# EAGLE design RefVolt (EAGLE 8.0.1)
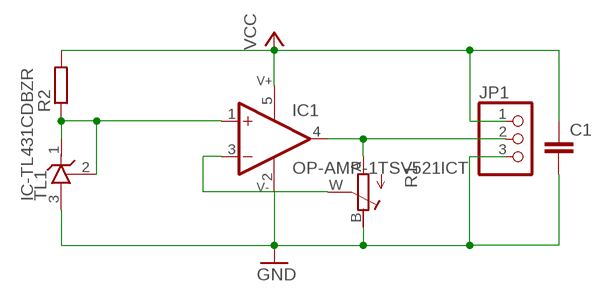
[diagram p0: schematic, sheet 1]

## Parts
C1  CAP_0805  [C0805]
IC1  OP-AMP-1TSV521ICT  [SC70-5L]
JP1  PINHD-1X3/90  [1X03/90]
R1  R_POTTURN-X  [RJ9W]
R2  R_0805  [R0805]
TL1  IC-TL431CDBZR  [SOT23]

## Nets
GND: C1.2 IC1.2(V-) JP1.3 R1.B(E) TL1.3(A)
N$1: IC1.3(-IN) R1.W(S)
N$4: IC1.4(OUT) JP1.2 R1.A
N$7: IC1.1(+IN) R2.1 TL1.1(C) TL1.2(R)
VCC: C1.1 IC1.5(V+) JP1.1 R2.2

## Library data of the parts
C1 = Namenlos:CAP_
IC1 = Namenlos:OP-AMP-1
JP1 = pinhead:PINHD-1X3: PIN HEADER
R1 = Namenlos:R_POT
R2 = Namenlos:R_
TL1 = Namenlos:IC-TL431

## Board
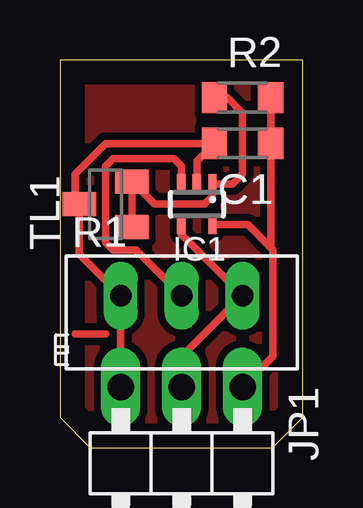
[diagram p1: board, top side]

Size 10.14 x 16.18 mm. Coordinates in mm from the lower left corner, seen from the top.
Outline: 0,16.18 0,1.27 1.27,0 8.87,0 10.14,1.27 10.14,16.18 0,16.18
Copper layers (1*16): Top 0.035mm / dielectric 1.5mm / Bottom 0.035mm
Design rules "default": minimum track width 10mil, minimum drill 24mil, track to track 8mil, track to pad 8mil, pad to pad 8mil, via to via 8mil, smd to smd 8mil, copper to edge 40mil, drill to drill 8mil, minimum pad ring 10mil, minimum via ring 8mil, stop-mask expansion 4mil, vias tented up to drill 0mil, thermal gap 10mil

### Footprints (pad centres in the part's own frame; a part is rotated, then mirrored left to right if it is on the bottom)
C0805 = smd 1.05 x 1.3: 1 -1.175,0; 2 1.175,0
SC70-5L = smd 0.35 x 0.8: 1 -0.65,-0.85; 2 0,-0.85; 3 0.65,-0.85; 4 0.65,0.85; 5 -0.65,0.85
1X03/90 = drill 1.1 long: 1 -2.54,-3.81; 2 0,-3.81; 3 2.54,-3.81
RJ9W = drill 0.9 long: A 2.54,0.635; B -2.54,0.635; W 0,0.635
R0805 = smd 1.05 x 1.3: 1 -1.175,0; 2 1.175,0
SOT23 = smd 1 x 1.4: 1 -0.95,-1.1; 2 0.95,-1.1; 3 0,1.1

### Placement (x,y rotation side)
C1  7.62,12.7 180 top
IC1  5.71,10.16 180 top
JP1  5.08,-1.27 180 top
R1  5.08,5.71 0 top
R2  7.62,14.61 0 top
TL1  1.91,10.16 90 top

### Tracks (layer width: path | path; a pad name or v marks a point on that pad's centre or on a via)
GND
  Top 0.305: JP1.3 R1.B 0.8,8.09 TL1.3 0.64,10.33 0.64,11.43 1.91,12.7 C1.2 5.71,11.97 IC1.2
N$1
  Top 0.305: R1.W 3.17,8.26 2.22,8.26 1.91,8.57 1.91,11.75 2.22,12.06 4.76,12.06 5.08,11.75 5.08,11.03 IC1.3
N$2
  pour Top (isolate 0.305): 1.27,0 0,1.27 0,16.51 10.16,16.51 10.16,1.27 8.89,0
N$4
  Top 0.305: JP1.2 5.08,3.81 R1.A 5.06,8.9 IC1.4
N$6
  Top 0.305: 0.64,4.76 1.91,4.76
N$7
  Top 0.305: R2.1 6.98,14.61 7.62,13.97 7.62,11.43 7.2,11.01 IC1.1 6.37,10.49 6.03,10.16 3.96,10.16 TL1.2 TL1.1
VCC
  Top 0.305: JP1.1 8.89,3.81 8.89,8.26 | IC1.5 7.84,9.31 8.89,8.26 | R2.2 C1.1 8.79,8.35 8.89,8.26

### Text on the board
_tNames: R2 | C1 | IC1 | TL1 | R1 | JP1